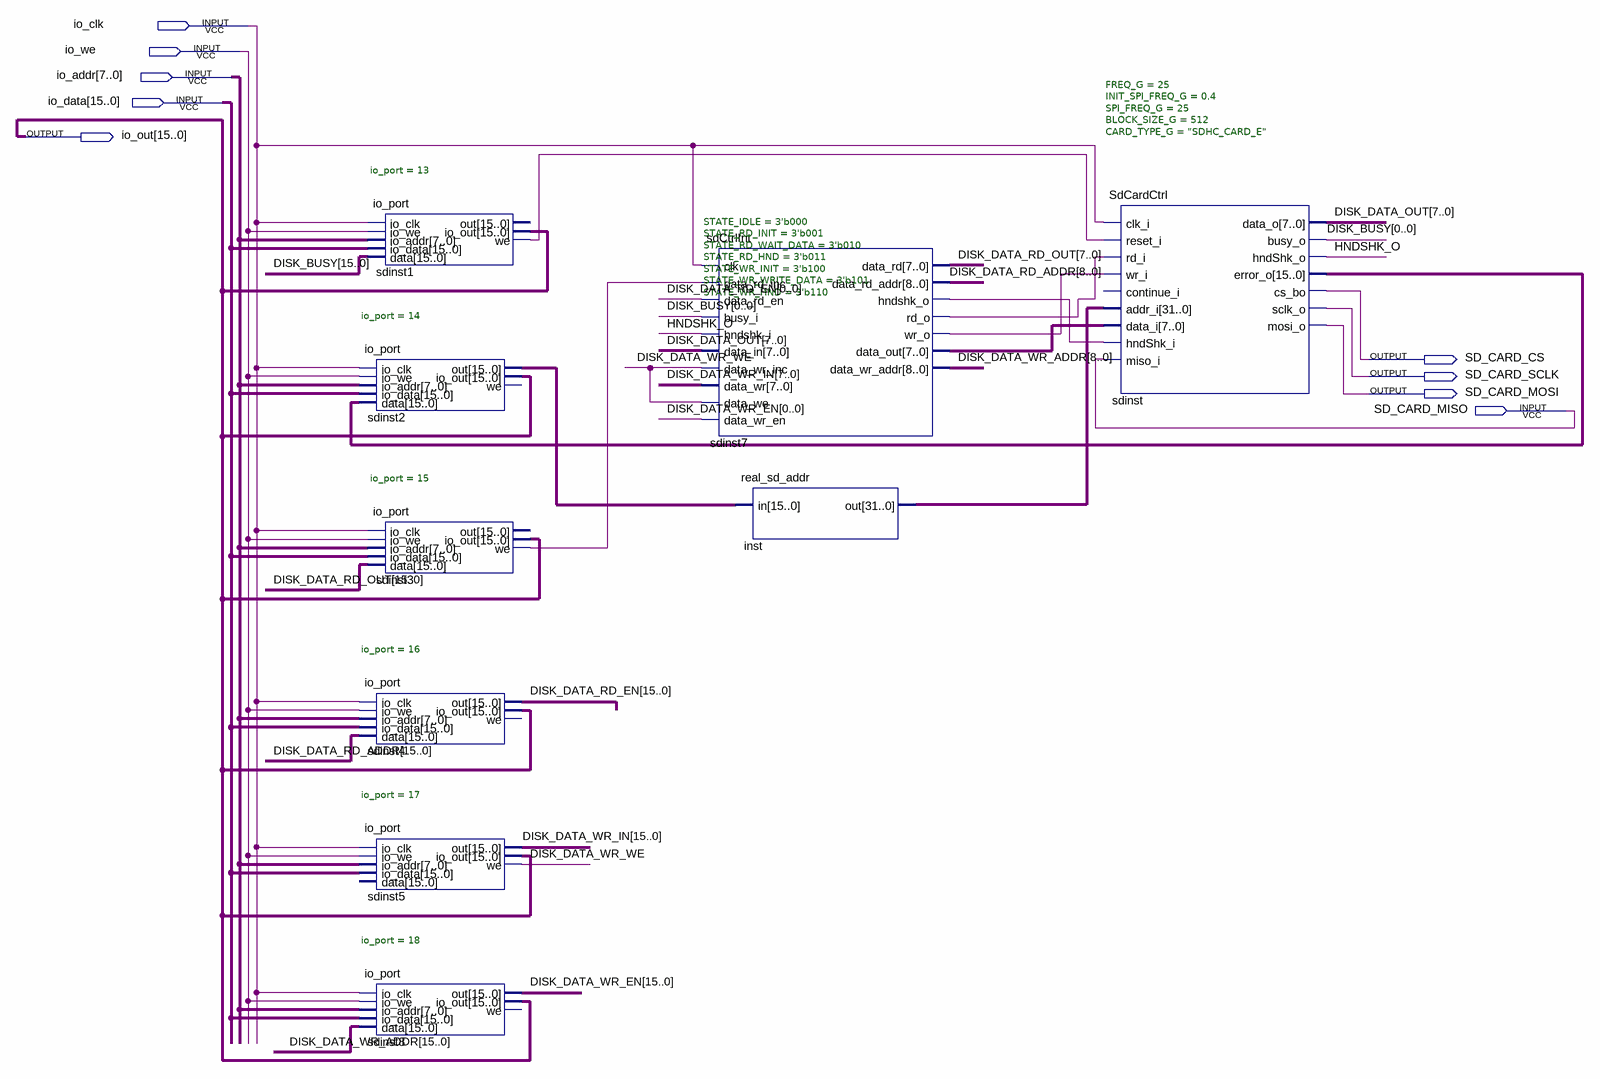
[diagram p0: schematic sheet]
// Quartus schematic sd_io.bdf as structural Verilog: 9 symbols, 9 pins
module sd_io (
  input  io_clk,
  input  io_we,
  input  [7:0] io_addr,
  input  [15:0] io_data,
  input  SD_CARD_MISO,
  output [15:0] io_out,
  output SD_CARD_CS,
  output SD_CARD_SCLK,
  output SD_CARD_MOSI
);

  wire DISK_DATA_WR_WE, HNDSHK_O, sdinst1_we, sdinst3_we, sdinst7_hndshk_o, sdinst7_rd_o, sdinst7_wr_o;
  wire [7:0] DISK_DATA_OUT, sdinst7_data_out;
  wire [15:0] DISK_BUSY, DISK_DATA_RD_ADDR, DISK_DATA_RD_EN, DISK_DATA_RD_OUT, DISK_DATA_WR_ADDR,
       DISK_DATA_WR_EN, DISK_DATA_WR_IN, sdinst2_out, sdinst_error_o;
  wire [31:0] inst_out;

  io_port #(.io_port(14)) sdinst2 (
    .io_clk(io_clk), .io_we(io_we), .io_addr(io_addr), .io_data(io_data), .data(sdinst_error_o),
    .out(sdinst2_out), .io_out(io_out));  // open: we
  io_port #(.io_port(16)) sdinst4 (
    .io_clk(io_clk), .io_we(io_we), .io_addr(io_addr), .io_data(io_data), .data(DISK_DATA_RD_ADDR),
    .out(DISK_DATA_RD_EN), .io_out(io_out));  // open: we
  io_port #(.io_port(17)) sdinst5 (
    .io_clk(io_clk), .io_we(io_we), .io_addr(io_addr), .io_data(io_data), .out(DISK_DATA_WR_IN),
    .io_out(io_out), .we(DISK_DATA_WR_WE));  // open: data
  io_port #(.io_port(18)) sdinst8 (
    .io_clk(io_clk), .io_we(io_we), .io_addr(io_addr), .io_data(io_data), .data(DISK_DATA_WR_ADDR),
    .out(DISK_DATA_WR_EN), .io_out(io_out));  // open: we
  io_port #(.io_port(13)) sdinst1 (
    .io_clk(io_clk), .io_we(io_we), .io_addr(io_addr), .io_data(io_data), .data(DISK_BUSY), .io_out(io_out),
    .we(sdinst1_we));  // open: out
  io_port #(.io_port(15)) sdinst3 (
    .io_clk(io_clk), .io_we(io_we), .io_addr(io_addr), .io_data(io_data), .data(DISK_DATA_RD_OUT),
    .io_out(io_out), .we(sdinst3_we));  // open: out
  sdCtrlInt #(.STATE_IDLE(3'b000), .STATE_RD_INIT(3'b001), .STATE_RD_WAIT_DATA(3'b010), .STATE_RD_HND(3'b011), .STATE_WR_INIT(3'b100), .STATE_WR_WRITE_DATA(3'b101), .STATE_WR_HND(3'b110)) sdinst7 (
    .clk(io_clk), .data_rd_inc(sdinst3_we), .data_rd_en(DISK_DATA_RD_EN[0]), .busy_i(DISK_BUSY[0]),
    .hndshk_i(HNDSHK_O), .data_in(DISK_DATA_OUT), .data_wr_inc(DISK_DATA_WR_WE),
    .data_wr(DISK_DATA_WR_IN[7:0]), .data_we(DISK_DATA_WR_WE), .data_wr_en(DISK_DATA_WR_EN[0]),
    .data_rd(DISK_DATA_RD_OUT[7:0]), .data_rd_addr(DISK_DATA_RD_ADDR[8:0]), .hndshk_o(sdinst7_hndshk_o),
    .rd_o(sdinst7_rd_o), .wr_o(sdinst7_wr_o), .data_out(sdinst7_data_out),
    .data_wr_addr(DISK_DATA_WR_ADDR[8:0]));
  real_sd_addr inst (.in(sdinst2_out), .out(inst_out));
  SdCardCtrl #(.FREQ_G(25), .INIT_SPI_FREQ_G(0.4), .SPI_FREQ_G(25), .BLOCK_SIZE_G(512), .CARD_TYPE_G("SDHC_CARD_E")) sdinst (
    .clk_i(io_clk), .reset_i(sdinst1_we), .rd_i(sdinst7_rd_o), .wr_i(sdinst7_wr_o), .addr_i(inst_out),
    .data_i(sdinst7_data_out), .hndShk_i(sdinst7_hndshk_o), .miso_i(SD_CARD_MISO), .data_o(DISK_DATA_OUT),
    .busy_o(DISK_BUSY[0]), .hndShk_o(HNDSHK_O), .error_o(sdinst_error_o), .cs_bo(SD_CARD_CS),
    .sclk_o(SD_CARD_SCLK), .mosi_o(SD_CARD_MOSI));  // open: continue_i
endmodule
